# EAGLE design TemperatureSensor (EAGLE 9.1.0)
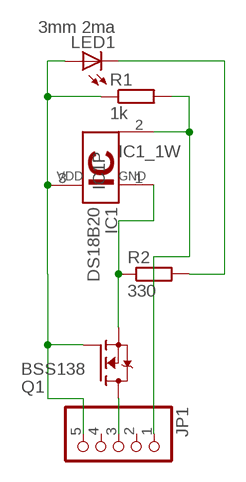
[diagram p0: schematic, sheet 1]

## Parts
IC1  DS18B20  [TO92-]
JP1  PINHD-1X5  [1X05]
LED1  3mm 2ma  TLLY4400  [LED3MM]
Q1  BSS138  [SOT23]
R1  1k  R-EU_R1206  [R1206]
R2  330  R-EU_R1206  [R1206]

## Nets
N$1: IC1.3 JP1.5 LED1.A Q1.1(G) R1.1
N$2: LED1.K(C) R2.2
N$3: JP1.3 Q1.3(D)
N$4: IC1.1 Q1.2(S) R2.1
N$5: IC1.2 JP1.1 R1.2
Unconnected: JP1.2 JP1.4

## Library data of the parts
IC1 = 1wire:DS18B20: Programmable Resolution Digital Thermometer This chip provides a onewire thermosensor with approx. 0.5°C accuracy. A programmable over/undertemperure alarm is available. The precision can be set from 9..12 bits. Notes: Vdd must be applied for accurate measurements at low temperatures, as the parasite power circuit otherwise heats the sensor. If parasite power is used, Vdd has to be connected to GND. The DS1822 is a low-cost thermometer chip, the DS18S20 is similar to the DS18B20, but with 9 Bit precision only. Author: Jan Kandziora <jjj@gmx.de>
JP1 = pinhead:PINHD-1X5: PIN HEADER
LED1 = led:TLLY4400: Low Current (2mA) LED 3 mm Tinted Diffused Package color YELLOW Source: Data sheet <http://www.farnell.com/datasheets/391098.pdf>; MF: VISHAY SEMICONDUCTOR; OC_FARNELL: 1612439
Q1 = Cing Library:BSS138: BSS138 N-Channel Logic Level Enhancement Mode Field Effect Transistor Source: http://www.fairchildsemi.com/datasheets/BS/BSS138.pdf; MF: Fairchild; MPN: BSS138; OC_FARNELL: 9845330; OC_NEWARK: 67R2009
R1 R2 = rcl:R-EU_: RESISTOR, European symbol

## Board
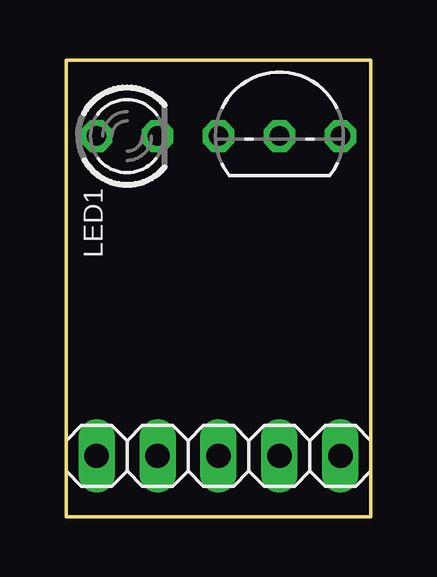
[diagram p1: board, top side]
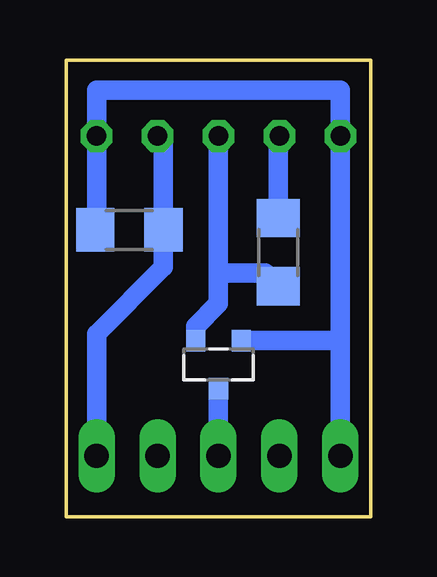
[diagram p2: board, bottom side, seen from below]

Size 12.7 x 19.05 mm. Coordinates in mm from the lower left corner, seen from the top.
Outline: 0,0 0,19.05 12.7,19.05 12.7,0 0,0
Copper layers (1*16): Top 0.035mm / dielectric 1.5mm / Bottom 0.035mm
Design rules "default *": minimum track width 10mil, minimum drill 24mil, track to track 8mil, track to pad 8mil, pad to pad 8mil, via to via 8mil, smd to smd 8mil, copper to edge 10mil, drill to drill 8mil, minimum pad ring 10mil, minimum via ring 8mil, stop-mask expansion 4mil, vias tented up to drill 0mil, thermal gap 10mil

### Footprints (pad centres in the part's own frame; a part is rotated, then mirrored left to right if it is on the bottom)
TO92- = drill 0.813 octagon: 1 -2.54,0; 2 0,0; 3 2.54,0
1X05 = drill 1.016 long: 1 -5.08,0; 2 -2.54,0; 3 0,0; 4 2.54,0; 5 5.08,0
LED3MM = drill 0.813 octagon: A -1.27,0; K 1.27,0
SOT23 = smd 0.8 x 0.9: 1 -0.95,-1; 2 0.95,-1; 3 0,1
R1206 = smd 1.6 x 1.803: 1 -1.422,0; 2 1.422,0

### Placement (x,y rotation side)
IC1  8.89,15.88 0 top
JP1  6.35,2.54 180 top
LED1  2.54,15.88 0 top
Q1  6.35,6.35 180 bottom
R1  10.06,11.96 0 bottom
R2  3.87,11.04 90 bottom

### Tracks (layer width: path | path; a pad name or v marks a point on that pad's centre or on a via)
N$1
  Bottom 0.813: JP1.5 1.27,7.62 | 1.27,7.62 LED1.A 1.27,17.78 11.43,17.78 IC1.3 11.43,12.02 R1.1 | Q1.1 1.54,7.35 1.27,7.62
N$2
  Bottom 0.813: LED1.K 3.87,15.82 R2.2
N$3
  Bottom 0.813: Q1.3 JP1.3
N$4
  Bottom 0.813: Q1.2 7.3,7.94 6.35,8.89 6.35,10.16 | IC1.1 6.35,10.16 | R2.1 4.41,10.16 6.35,10.16
N$5
  Bottom 0.813: IC1.2 8.64,15.63 R1.2 8.64,10.41 11.43,7.62 JP1.1